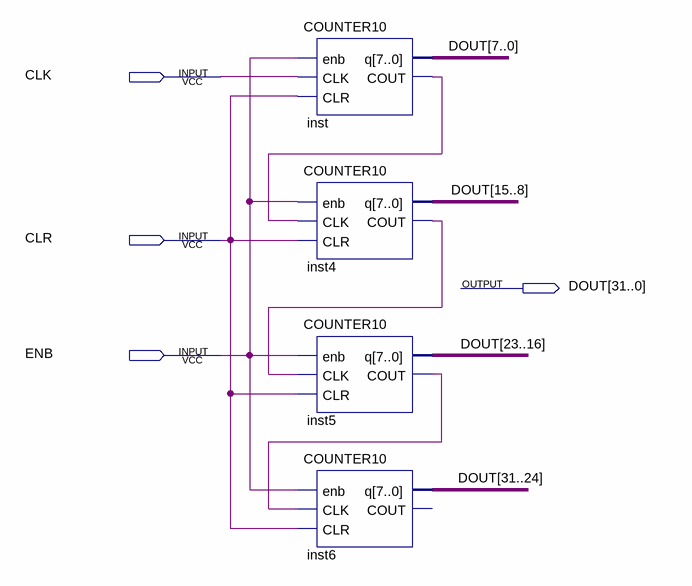
[diagram p0: schematic sheet]
// Quartus schematic CNT32B.bdf as structural Verilog: 4 symbols, 4 pins
module CNT32B (
  input  CLK,
  input  CLR,
  input  ENB,
  output [31:0] DOUT
);

  wire inst4_cout, inst5_cout, inst_cout;

  COUNTER10 inst (.enb(ENB), .CLK(CLK), .CLR(CLR), .q(DOUT[7:0]), .COUT(inst_cout));
  COUNTER10 inst4 (.enb(ENB), .CLK(inst_cout), .CLR(CLR), .q(DOUT[15:8]), .COUT(inst4_cout));
  COUNTER10 inst5 (.enb(ENB), .CLK(inst4_cout), .CLR(CLR), .q(DOUT[23:16]), .COUT(inst5_cout));
  COUNTER10 inst6 (.enb(ENB), .CLK(inst5_cout), .CLR(CLR), .q(DOUT[31:24]));  // open: COUT
endmodule
